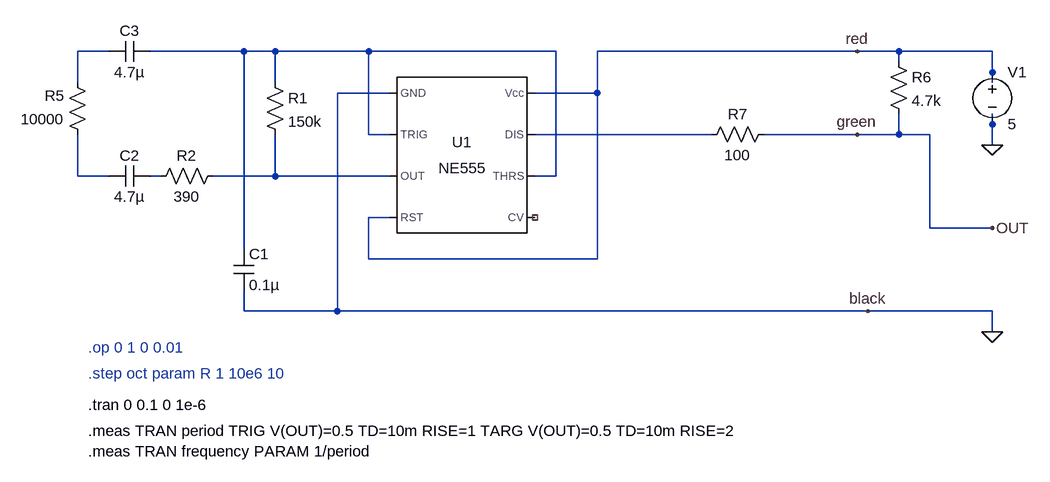
[diagram p0: schematic SMX_simulation_v3.asc]
SMX_simulation_v3.asc, the LTspice schematic file:
Version 4
SHEET 1 1828 708
WIRE -352 16 -400 16
WIRE -144 16 -288 16
WIRE -96 16 -144 16
WIRE 48 16 -96 16
WIRE 336 16 48 16
WIRE 800 16 400 16
WIRE 864 16 800 16
WIRE 1008 16 864 16
WIRE 864 32 864 16
WIRE 1008 48 1008 16
WIRE -400 64 -400 16
WIRE -96 64 -96 16
WIRE 1008 64 1008 48
WIRE 80 80 0 80
WIRE 400 80 400 16
WIRE 400 80 304 80
WIRE 1008 128 1008 112
WIRE 48 144 48 16
WIRE 80 144 48 144
WIRE 576 144 304 144
WIRE 800 144 656 144
WIRE 864 144 864 112
WIRE 864 144 800 144
WIRE 912 144 864 144
WIRE 1008 160 1008 128
WIRE -400 208 -400 144
WIRE -352 208 -400 208
WIRE -272 208 -288 208
WIRE -96 208 -96 144
WIRE -96 208 -192 208
WIRE 80 208 -96 208
WIRE 336 208 336 16
WIRE 336 208 304 208
WIRE 80 272 48 272
WIRE 912 288 912 144
WIRE 1008 288 912 288
WIRE -144 320 -144 16
WIRE 48 336 48 272
WIRE 400 336 400 80
WIRE 400 336 48 336
WIRE -144 416 -144 384
WIRE 0 416 0 80
WIRE 0 416 -144 416
WIRE 816 416 0 416
WIRE 1008 416 816 416
WIRE 1008 448 1008 416
FLAG 800 16 red
FLAG 816 416 black
FLAG 800 144 green
FLAG 1008 160 0
FLAG 1008 448 0
FLAG 1008 288 OUT
SYMBOL Misc\\NE555 192 176 R0
SYMATTR InstName U1
SYMBOL res -112 48 R0
SYMATTR InstName R1
SYMATTR Value 150k
SYMBOL res -176 192 R90
WINDOW 0 0 56 VBottom 2
WINDOW 3 32 56 VTop 2
SYMATTR InstName R2
SYMATTR Value 390
SYMBOL cap -288 192 R90
WINDOW 0 0 32 VBottom 2
WINDOW 3 32 32 VTop 2
SYMATTR InstName C2
SYMATTR Value 4.7µ
SYMBOL cap -352 32 R270
WINDOW 0 32 32 VTop 2
WINDOW 3 0 32 VBottom 2
SYMATTR InstName C3
SYMATTR Value 4.7µ
SYMBOL voltage 1008 32 R0
WINDOW 123 0 0 Left 0
WINDOW 39 0 0 Left 0
SYMATTR InstName V1
SYMATTR Value 5
SYMBOL res -384 160 R180
WINDOW 0 36 76 Left 2
WINDOW 3 36 40 Left 2
SYMATTR InstName R5
SYMATTR Value 10000
SYMBOL res 560 160 R270
WINDOW 0 32 56 VTop 2
WINDOW 3 0 56 VBottom 2
SYMATTR InstName R7
SYMATTR Value 100
SYMBOL cap -160 320 R0
SYMATTR InstName C1
SYMATTR Value 0.1µ
SYMBOL res 848 16 R0
SYMATTR InstName R6
SYMATTR Value 4.7k
TEXT -384 512 Left 2 ;.step oct param R 1 10e6 10
TEXT -384 472 Left 2 ;.op 0 1 0 0.01
TEXT -384 560 Left 2 !.tran 0 0.1 0 1e-6
TEXT -384 600 Left 2 !.meas TRAN period TRIG V(OUT)=0.5 TD=10m RISE=1 TARG V(OUT)=0.5 TD=10m RISE=2
TEXT -384 632 Left 2 !.meas TRAN frequency PARAM 1/period

The netlist it stands for:
* SMX_simulation_v3.asc
XU1 0 N002 N006 red NC_01 N002 N003 red NE555  ; pins GND TRIG OUT RST CV THRS DIS Vcc
R1 N002 N006 150k
R2 N006 N005 390
C2 N005 N004 4.7µ
C3 N001 N002 4.7µ
V1 red 0 5
R5 N004 N001 10000
R7 N003 OUT 100
C1 N002 0 0.1µ
R6 red OUT 4.7k
* .step oct param R 1 10e6 10
* .op 0 1 0 0.01
.tran 0 0.1 0 1e-6
.meas TRAN period TRIG V(OUT)=0.5 TD=10m RISE=1 TARG V(OUT)=0.5 TD=10m RISE=2
.meas TRAN frequency PARAM 1/period
.lib NE555.sub
.backanno
.end